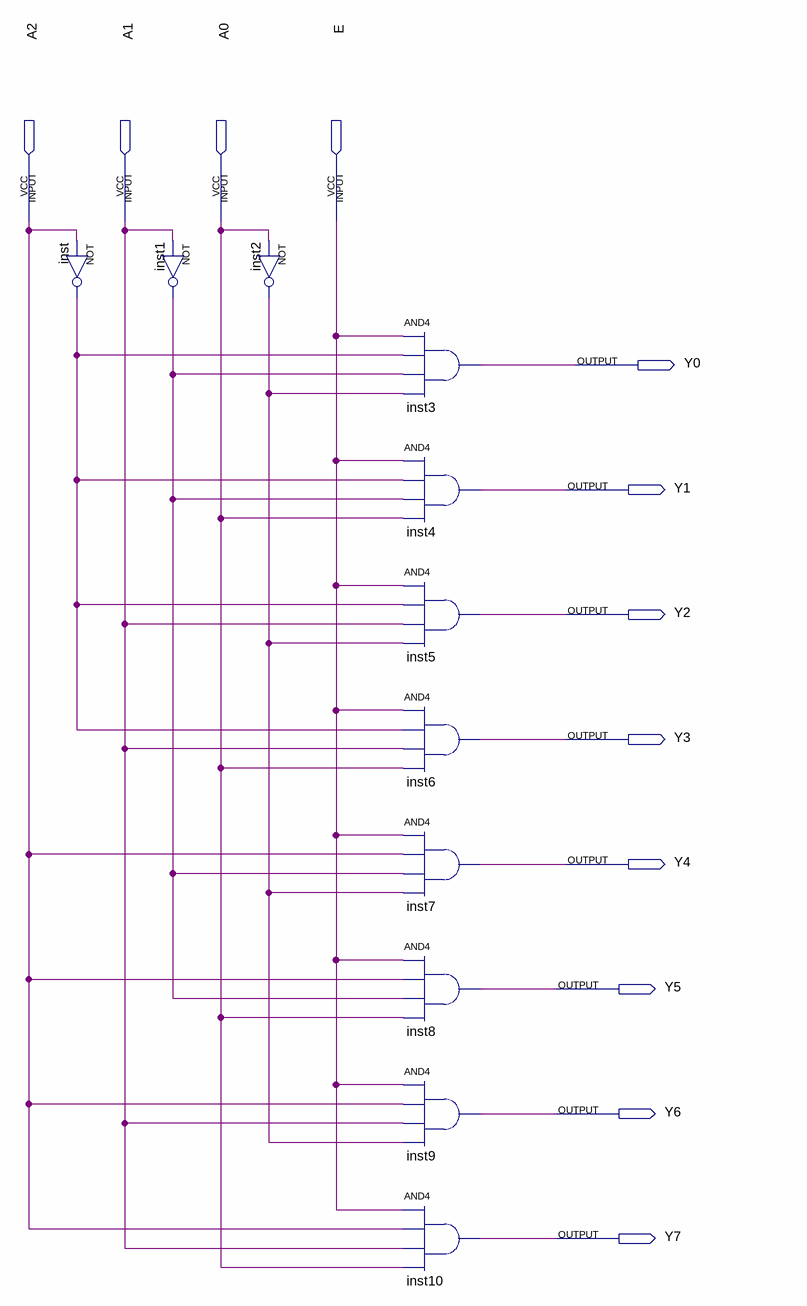
[diagram p0: schematic sheet]
// Quartus schematic DECODER38.bdf as structural Verilog: 11 symbols, 12 pins
module DECODER38 (
  input  A2,
  input  A1,
  input  A0,
  input  E,
  output Y0,
  output Y1,
  output Y2,
  output Y3,
  output Y4,
  output Y5,
  output Y6,
  output Y7
);

  wire inst1_out, inst2_out, inst_out;

  not inst (inst_out, A2);
  not inst1 (inst1_out, A1);
  not inst2 (inst2_out, A0);
  and inst3 (Y0, E, inst_out, inst1_out, inst2_out);
  and inst4 (Y1, E, inst_out, inst1_out, A0);
  and inst5 (Y2, E, inst_out, A1, inst2_out);
  and inst6 (Y3, E, inst_out, A1, A0);
  and inst7 (Y4, E, A2, inst1_out, inst2_out);
  and inst8 (Y5, E, A2, inst1_out, A0);
  and inst9 (Y6, E, A2, A1, inst2_out);
  and inst10 (Y7, E, A2, A1, A0);
endmodule
